# Altium schematic sheet main_board.SchDoc
size A4; SheetNumber: 1; SheetTotal: 2
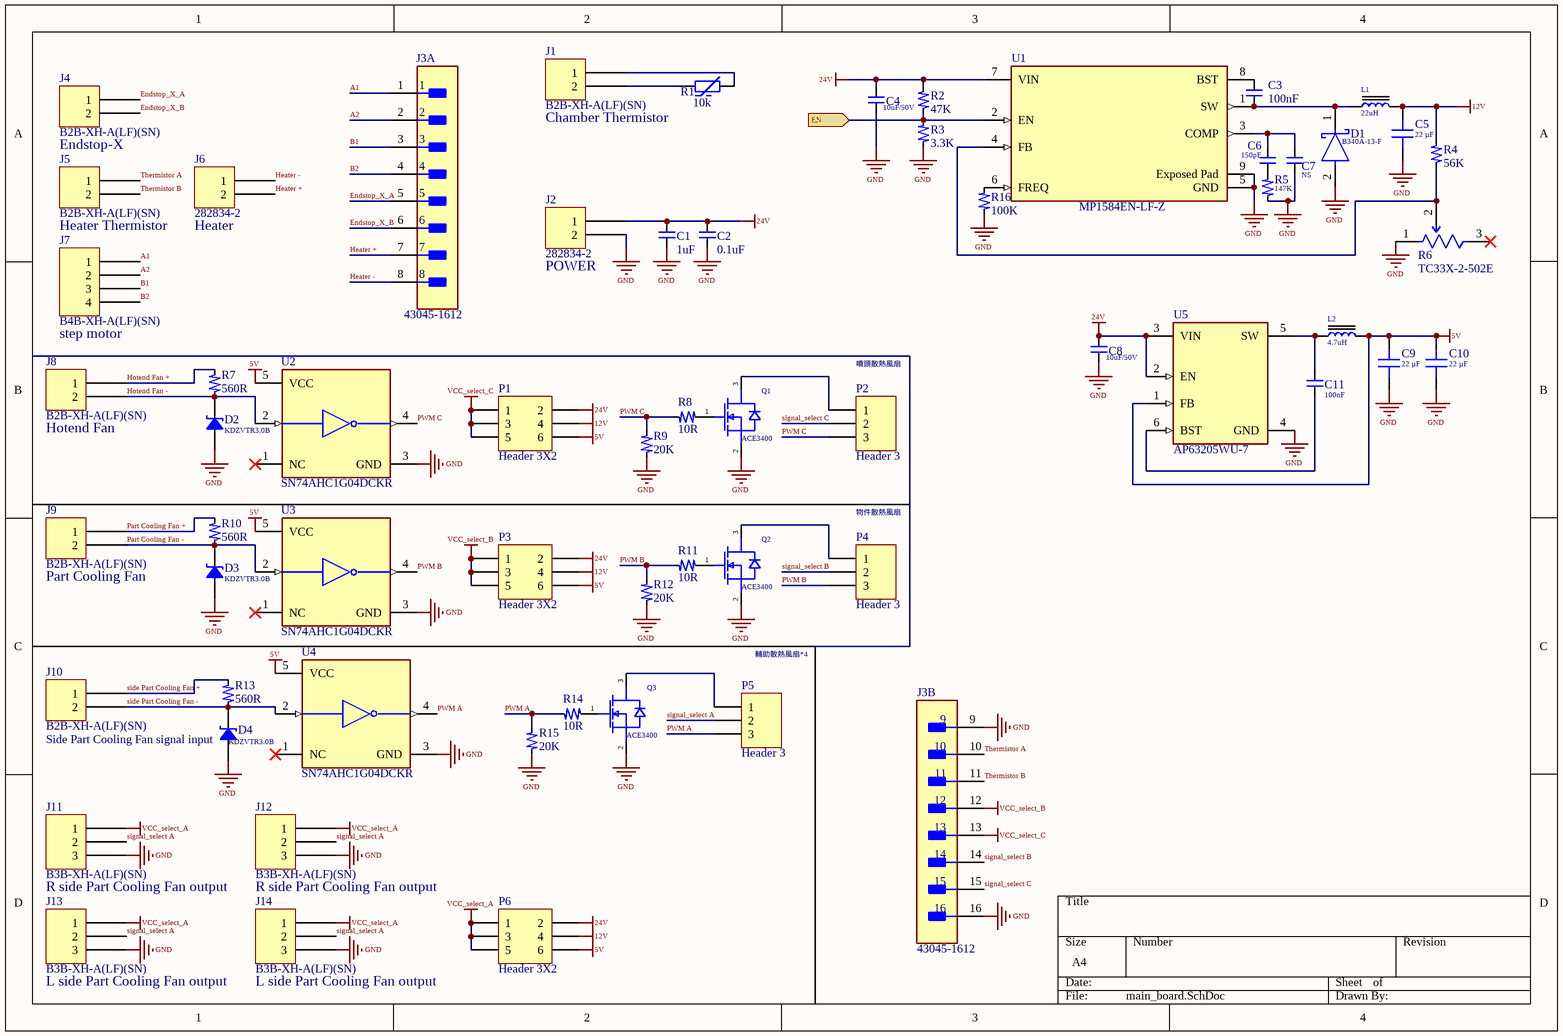
[diagram p0: main_board.SchDoc]

## Parts
C1  1uF  [0603 R]
C2  0.1uF  [0603 R]
C3  100nF  [0603 R]
C4  10uF/50V  [0603 R]
C5  22 µF  [CAP 1206_3216 - 0.8MM]
C6  150pF  [0603 R]
C7  NS  [0603 R]
C8  10uF/50V  [0603 R]
C9  22 µF  [CAP 1206_3216 - 0.8MM]
C10  22 µF  [CAP 1206_3216 - 0.8MM]
C11  100nF  [0603 R]
D1  B340A-13-F  [FP-SMA-MFG]
D2  KDZVTR3.0B  [SOD123F]
D3  KDZVTR3.0B  [SOD123F]
D4  KDZVTR3.0B  [SOD123F]
J1  B2B-XH-A(LF)(SN)  [JST XH B2B-XH-A]
J2  282834-2  [TE 282834-2]
J3  43045-1612  [FP-43045-1612-MFG]  (parts A,B of 2)
J4  B2B-XH-A(LF)(SN)  [JST XH B2B-XH-A]
J5  B2B-XH-A(LF)(SN)  [JST XH B2B-XH-A]
J6  282834-2  [TE 282834-2]
J7  B4B-XH-A(LF)(SN)  [JST XH B4B-XH-A]
J8  B2B-XH-A(LF)(SN)  [JST XH B2B-XH-A]
J9  B2B-XH-A(LF)(SN)  [JST XH B2B-XH-A]
J10  B2B-XH-A(LF)(SN)  [JST XH B2B-XH-A]
J11  B3B-XH-A(LF)(SN)  [JST XH B3B-XH-A]
J12  B3B-XH-A(LF)(SN)  [JST XH B3B-XH-A]
J13  B3B-XH-A(LF)(SN)  [JST XH B3B-XH-A]
J14  B3B-XH-A(LF)(SN)  [JST XH B3B-XH-A]
L1  22uH  [0850 I]
L2  4.7uH  [0630 I]
P1  Header 3X2  [HDR2X3]
P2  Header 3  [HDR1X3]
P3  Header 3X2  [HDR2X3]
P4  Header 3  [HDR1X3]
P5  Header 3  [HDR1X3]
P6  Header 3X2  [HDR2X3]
Q1  ACE3400  [SOT23-3]
Q2  ACE3400  [SOT23-3]
Q3  ACE3400  [SOT23-3]
R1  10k  [NTC 0805_2012]
R2  47K  [0603 R]
R3  3.3K  [0603 R]
R4  56K  [0603 R]
R5  147K  [0603 R]
R6  TC33X-2-502E  [FP-TC33X-2-MFG]
R7  560R  [0603 R]
R8  10R  [0603 R]
R9  20K  [0603 R]
R10  560R  [0603 R]
R11  10R  [0603 R]
R12  20K  [0603 R]
R13  560R  [0603 R]
R14  10R  [0603 R]
R15  20K  [0603 R]
R16  100K  [0603 R]
U1  MP1584EN-LF-Z  [FP-MP1584EN-LF-Z-MFG]
U2  SN74AHC1G04DCKR  [FP-DCK0005A-MFG]
U3  SN74AHC1G04DCKR  [FP-DCK0005A-MFG]
U4  SN74AHC1G04DCKR  [FP-DCK0005A-MFG]
U5  AP63205WU-7  [FP-TSOT26-MFG]

## Ports
EN (in)

## Nets
5V: C9.2 C10.2 L2.2 P1.6 P3.6 P6.6 U2.5(VCC) U3.5(VCC) U4.5(VCC) U5.1(FB)
12V: C5.2 L1.2 P1.4 P3.4 P6.4 R4.2
24V: C1.2 C2.2 C4.2 C8.2 J2.1 P1.2 P3.2 P6.2 R2.1 U1.7(VIN) U5.2(EN) U5.3(VIN)
GND: C1.1 C2.1 C4.1 C5.1 C7.1 C8.1 C9.1 C10.1 D1.2(A) D2.1 D3.1 D4.1 J2.2 J3.9 J3.16 J11.3 J12.3 J13.3 J14.3 Q1.2(S) Q2.2(S) Q3.2(S) R3.2 R5.2 R6.1(CCW) R9.1 R12.1 R15.1 R16.2 U1.5(GND) U1.9(Exposed_Pad) U2.3(GND) U3.3(GND) U4.3(GND) U5.4(GND)
VCC_select_A: J11.1 J12.1 J13.1 J14.1 P6.1 P6.3 P6.5
VCC_select_B: J3.12 P3.1 P3.3 P3.5
VCC_select_C: J3.13 P1.1 P1.3 P1.5
A1: J3.1 J7.1
A2: J3.2 J7.2
B1: J3.3 J7.3
B2: J3.4 J7.4
EN: R2.2 R3.1 U1.2(EN) ; port EN
Endstop_X_A: J3.5 J4.1
Endstop_X_B: J3.6 J4.2
Heater +: J3.7 J6.2
Heater -: J3.8 J6.1
Hotend Fan +: J8.1 R7.2
Hotend Fan -: D2.2 J8.2 R7.1 U2.2(A)
Part Cooling Fan +: J9.1 R10.2
Part Cooling Fan -: D3.2 J9.2 R10.1 U3.2(A)
PWM A: P5.3 R14.2 R15.2 U4.4(Y)
PWM B: P4.3 R11.2 R12.2 U3.4(Y)
PWM C: P2.3 R8.2 R9.2 U2.4(Y)
side Part Cooling Fan +: J10.1 R13.2
side Part Cooling Fan -: D4.2 J10.2 R13.1 U4.2(A)
signal_select A: J11.2 J12.2 J13.2 J14.2 P5.2
signal_select B: J3.14 P4.2
signal_select C: J3.15 P2.2
Thermistor A: J3.10 J5.1
Thermistor B: J3.11 J5.2
NetC3_1: C3.1 D1.1(C) L1.1 U1.1(SW)
NetC3_2: C3.2 U1.8(BST)
NetC6_1: C6.1 R5.1
NetC6_2: C6.2 C7.2 U1.3(COMP)
NetC11_1: C11.1 U5.6(BST)
NetC11_2: C11.2 L2.1 U5.5(SW)
NetJ1_1: J1.1 R1.2
NetJ1_2: J1.2 R1.1
NetP2_1: P2.1 Q1.3(D)
NetP4_1: P4.1 Q2.3(D)
NetP5_1: P5.1 Q3.3(D)
NetQ1_1: Q1.1(G) R8.1
NetQ2_1: Q2.1(G) R11.1
NetQ3_1: Q3.1(G) R14.1
NetR4_1: R4.1 R6.2(WIPER) U1.4(FB)
NetR16_1: R16.1 U1.6(FREQ)

Not connected (* = marked no-connect by the designer): R6 3(CW)*; U2 1(NC)*; U3 1(NC)*; U4 1(NC)*

## Notes on the sheet
- Endstop-X
- Chamber Thermistor
- Heater Thermistor
- (near J6) Heater
- (near J2) POWER
- step motor
- (near P2) 噴頭散熱風扇
- (near J8) Hotend Fan
- (near P4) 物件散熱風扇
- (near J9) Part Cooling Fan
- 輔助散熱風扇*4
- (near D4) Side Part Cooling Fan signal input
- R side Part Cooling Fan output
- L side Part Cooling Fan output

## Library data of the parts
C1-C4 C6-C8 C11 = Capacitors
C5 C9 C10 = GRM31CC81E226KE11L: CAP CER 22UF 25V X6S 1206; manufacturer: Murata Electronics; Tolerance: ±10%; Part Number: GRM31CC81E226KE11L; Value: 22 µF; Applications: General Purpose; Capacitance: 22 µF; componentlink1description: Datasheet; componentlink1url: https://search.murata.co.jp/Ceramy/image/img/A01X/G101/ENG/GRM31CC81E226KE11-01.pdf; componentlink2description: DigiKey Link; componentlink2url: https://www.digikey.com/en/products/detail/murata-electronics/GRM31CC81E226KE11L/6606097; Device Package: 1206 (3216 Metric); lastupdated: 2022/9/19 下午 01:06:42; Lifecycle Status: Active; Minimum Order: 1; Mounting Type: Surface Mount, MLCC; Operating Temperature: -55°C ~ 105°C; Package / Case: 1206 (3216 Metric); packaging: TapeAndReel; partid: 31407; Part Status: Active; price: 0.33; series: GRM; Size / Dimension: 0.126" L x 0.063" W (3.20mm x 1.60mm); Supplier 1: DigiKey; Supplier Part Number 1: 490-14468-1-ND; Temperature Coefficient: X6S; Thickness (Max): 0.075" (1.90mm); Voltage - Rated: 25V
D1 = CMP-1667-00003-3: DIODE SCHOTTKY 40V 3A SMA; Max Forward Surge Current (Ifsm): 80A; Forward Voltage: 500mV; Polarity: Standard; Max Reverse Current: 500uA; Capacitance: 250pF; Element Configuration: Single; Mount: Surface Mount; Output Current: 3A; Radiation Hardening: No; Width: 2.92mm; Current Rating: 3A; Termination: SMD/SMT; Voltage: 40V; Series: -; Max Operating Temperature: 125°C; Current: 3A; Max Repetitive Reverse Voltage (Vrrm): 40V; Min Operating Temperature: -55°C; REACH SVHC: No SVHC; Number of Pins: 2; Average Rectified Current: 3A; Contact Plating: Tin; RoHS Compliant: Yes; Max Reverse Voltage (DC): 40V; Packaging: Tape and Reel; Height: 2.3mm; Length: 4.6mm; Case/Package: SMA; Weight: 0.002258oz; Peak Non-Repetitive Surge Current: 80A; Package Quantity: 5000; Lead Free: Lead Free; Forward Current: 3A; Voltage Rating (DC): 40V
D2-D4 = KDZVTR3.0B: DIODE ZENER 3V 1W PMDU; Manufacturer: Rohm Semiconductor; Current - Reverse Leakage @ Vr: 100 µA @ 1 V; Tolerance: ±6.67%; Part Number: KDZVTR3.0B; ComponentLink1Description: Datasheet; ComponentLink1URL: https://www.rohm.com/datasheet/KDZV3.0B/kdzvtr3.0b-e; ComponentLink2Description: DigiKey Link; ComponentLink2URL: https://www.digikey.com/en/products/detail/rohm-semiconductor/KDZVTR3-0B/10670957; LastUpdated: 2022/9/19 下午 01:47:27; Lifecycle Status: Active; Minimum Order: 1; Mounting Type: Surface Mount; Operating Temperature: 150°C (TJ); Package / Case: SOD-123F; Packaging: TapeAndReel; PartId: 4172; Part Status: Active; Power - Max: 1 W; Price: 0.11; Series: -; Supplier 1: DigiKey; Supplier Part Number 1: 846-KDZVTR3.0BCT-ND; Supplier Device Package: PMDU; Voltage - Zener (Nom) (Vz): 3 V
J1 J4 J5 J8-J10 = B2B-XH-A(LF)(SN): CONN HEADER VERT 2POS 2.5MM; Manufacturer: JST Sales America Inc.; Contact Length - Post: 0.134" (3.40mm); Current Rating (Amps): 3A; Material Flammability Rating: UL94 V-0; Number of Positions: 2; Number of Positions Loaded: All; Pitch - Mating: 0.098" (2.50mm); Shrouding: Shrouded - 4 Wall; Style: Board to Cable/Wire; Voltage Rating: 250V; Part Number: B2B-XH-A(LF)(SN); ComponentLink1Description: Datasheet; ComponentLink1URL: http://www.jst-mfg.com/product/pdf/eng/eXH.pdf; ComponentLink2Description: DigiKey Link; ComponentLink2URL: http://digikey.com/product-detail/en/jst-sales-america-inc/B2B-XH-A-LF-SN/455-2247-ND/1651045; Connector Type: Header; Contact Finish - Mating: Tin; Contact Finish - Post: Tin; Contact Material: Brass; Contact Shape: Square; Contact Type: Male Pin; Fastening Type: Detent Lock; Insulation Color: Natural; Insulation Height: 0.276" (7.00mm); Insulation Material: Polyamide (PA66), Nylon 6/6; LastUpdated: 2020/1/12 下午 11:46:08; Lifecycle Status: Active; Minimum Order: 1; Mounting Type: Through Hole; Number of Rows: 1; Operating Temperature: -25°C ~ 85°C; Packaging: Bulk; PartId: 67; Part Status: Active; Price: 0.15; Series: XH; Supplier 1: DigiKey; Supplier Part Number 1: 455-2247-ND; Termination: Press-Fit, Solder
J2 J6 = 282834-2: TERM BLK 2P SIDE ENT 2.54MM PCB; Manufacturer: TE Connectivity AMP Connectors; Current: 10A; Mating Orientation: Horizontal with Board; Number of Levels: 1; Pitch: 0.100" (2.54mm); Positions Per Level: 2; Voltage: 150V; Wire Gauge: 16-30 AWG; Wire Termination: Screw - Rising Cage Clamp; Part Number: 282834-2; Color: Green; ComponentLink1Description: Datasheet; ComponentLink1URL: https://www.te.com/commerce/DocumentDelivery/DDEController?Action=srchrtrv&DocNm=282834&DocType=Customer+Drawing&DocLang=English; ComponentLink2Description: DigiKey Link; ComponentLink2URL: http://digikey.com/product-detail/en/te-connectivity-amp-connectors/282834-2/A98333-ND/1150135; LastUpdated: 2020/1/15 上午 04:15:38; Lifecycle Status: Active; Minimum Order: 1; Mounting Type: Through Hole; Packaging: Bulk; Part Status: Active; Price: 0.88; Series: Buchanan; Supplier 1: DigiKey; Supplier Part Number 1: A98333-ND
J3 = CMP-04776-000281-1: CONN HEADER VERT 16POS 3MM; Insulation Resistance: 1GR; Working Voltage: 250V; Number of Poles: 16; Current Rating: 5A; Mating Cycles: 30; Contact Resistance: 10mR; Max Voltage Rating (DC): 250.25kV; Approvals: UL; Connector Type: Power; Voltage Rating: 600V; Gender: Male; Glow Wire Compliant: Compliant; Series: 43045; Number of Rows: 2; Depth: 8.77mm; RoHS Compliant: Yes; Packaging: Tray; Height: 9.91mm; Housing Material: Thermoplastic; Mount: Through Hole; Lead Free: Lead Free; Max Current Rating: 5A; Halogen Free: Low Halogen; Length: 28.15mm; Material: Polyester; Voltage Rating (AC): 250V; Max Operating Temperature: 105°C; Contact Plating: Tin; Termination: Solder; Color: Black; Contact Material: Brass; Min Operating Temperature: -40°C; REACH SVHC: No SVHC; Orientation: Vertical; Package Quantity: 792; Voltage Rating (DC): 250V; Row Spacing: 3mm; Number of Contacts: 16; Housing Color: Black; Pitch: 3mm; Number of Circuits: 16; Operating Supply Voltage: 250V; Number of Positions: 16; Flammability Rating: UL94 V-0
J7 = B4B-XH-A(LF)(SN): CONN HEADER VERT 4POS 2.5MM; Manufacturer: JST Sales America Inc.; Contact Length - Post: 0.134" (3.40mm); Current Rating (Amps): 3A; Material Flammability Rating: UL94 V-0; Number of Positions: 4; Number of Positions Loaded: All; Pitch - Mating: 0.098" (2.50mm); Shrouding: Shrouded - 4 Wall; Style: Board to Cable/Wire; Voltage Rating: 250V; Part Number: B4B-XH-A(LF)(SN); ComponentLink1Description: Datasheet; ComponentLink1URL: http://www.jst-mfg.com/product/pdf/eng/eXH.pdf; ComponentLink2Description: DigiKey Link; ComponentLink2URL: http://digikey.com/product-detail/en/jst-sales-america-inc/B4B-XH-A-LF-SN/455-2249-ND/1651047; Connector Type: Header; Contact Finish - Mating: Tin; Contact Finish - Post: Tin; Contact Material: Brass; Contact Shape: Square; Contact Type: Male Pin; Fastening Type: Detent Lock; Insulation Color: Natural; Insulation Height: 0.276" (7.00mm); Insulation Material: Polyamide (PA66), Nylon 6/6; LastUpdated: 2020/1/12 下午 11:46:34; Lifecycle Status: Active; Minimum Order: 1; Mounting Type: Through Hole; Number of Rows: 1; Operating Temperature: -25°C ~ 85°C; Packaging: Bulk; PartId: 69; Part Status: Active; Price: 0.21; Series: XH; Supplier 1: DigiKey; Supplier Part Number 1: 455-2249-ND; Termination: Press-Fit, Solder
J11-J14 = B3B-XH-A(LF)(SN): CONN HEADER VERT 3POS 2.5MM; Manufacturer: JST Sales America Inc.; Contact Length - Post: 0.134" (3.40mm); Current Rating (Amps): 3A; Material Flammability Rating: UL94 V-0; Number of Positions: 3; Number of Positions Loaded: All; Pitch - Mating: 0.098" (2.50mm); Shrouding: Shrouded - 4 Wall; Style: Board to Cable/Wire; Voltage Rating: 250V; Part Number: B3B-XH-A(LF)(SN); ComponentLink1Description: Datasheet; ComponentLink1URL: http://www.jst-mfg.com/product/pdf/eng/eXH.pdf; ComponentLink2Description: DigiKey Link; ComponentLink2URL: http://digikey.com/product-detail/en/jst-sales-america-inc/B3B-XH-A-LF-SN/455-2248-ND/1651046; Connector Type: Header; Contact Finish - Mating: Tin; Contact Finish - Post: Tin; Contact Material: Brass; Contact Shape: Square; Contact Type: Male Pin; Fastening Type: Detent Lock; Insulation Color: Natural; Insulation Height: 0.276" (7.00mm); Insulation Material: Polyamide (PA66), Nylon 6/6; LastUpdated: 2020/1/12 下午 11:46:22; Lifecycle Status: Active; Minimum Order: 1; Mounting Type: Through Hole; Number of Rows: 1; Operating Temperature: -25°C ~ 85°C; Packaging: Bulk; PartId: 68; Part Status: Active; Price: 0.19; Series: XH; Supplier 1: DigiKey; Supplier Part Number 1: 455-2248-ND; Termination: Press-Fit, Solder
L1 L2 = Inductor
P1 P3 P6 = Header 3X2: Header, 3-Pin, Dual row; LatestRevisionDate: 17-Jul-2002; LatestRevisionNote: Re-released for DXP Platform.; Publisher: Altium Limited
P2 P4 P5 = Header 3: Header, 3-Pin; LatestRevisionDate: 17-Jul-2002; LatestRevisionNote: Re-released for DXP Platform.; Publisher: Altium Limited
R1 = NTCG203NF103JTDS: CASE EIA 0805 B= 1% ,10K? 5%; Manufacturer: TDK Corporation; B25/100: 3670K; B25/50: 3590K; B25/75: 3635K; B25/85: 3650K; Power - Max: 100mW; Part Number: NTCG203NF103JTDS; B Value Tolerance: ±1%; ComponentLink2Description: DigiKey Link; ComponentLink2URL: http://digikey.com/product-detail/en/tdk-corporation/NTCG203NF103JTDS/445-NTCG203NF103JTTR-ND/10820112; LastUpdated: 2020/8/30 下午 09:02:56; Lifecycle Status: Active; Minimum Order: 2000; Mounting Type: Surface Mount; Operating Temperature: -40°C ~ 125°C; Package / Case: 0805 (2012 Metric); Packaging: TapeAndReel; PartId: 1371; Price: 0.13; Resistance in Ohms @ 25°C: 10k; Resistance Tolerance: ±5%; Series: NTCG; Supplier 1: DigiKey; Supplier Part Number 1: 445-NTCG203NF103JTTR-ND; Value: 10k
R2-R5 R7-R16 = Resistors
R6 = CMP-07234-000040-1: TRIMMER 5K OHM 0.1W J LEAD TOP; Number of Turns: 1; Voltage Rating (DC): 50V; Power Rating: 100mW; Resistance Tolerance: 25%; Resistance: 100kR; Temperature Coefficient: 250ppm/°C; Max Operating Temperature: 100°C; Package Quantity: 2500; REACH SVHC: No SVHC; Termination: Foot Print; Packaging: Tape and Reel; RoHS Compliant: Yes; Military Standard: Not; Color: Silver; Width: 0.118inch; Min Operating Temperature: -40°C; Mount: Surface Mount; Height: 0.047inch; Tolerance: 25%; Resistor Type: Carbon; Length: 3mm; Depth: 3.8mm; Weight: 29.4mg; Max Power Dissipation: 100mW; Series: TC33; Radiation Hardening: No
U1 = CMP-57379-000006-1: IC REG BUCK ADJ 3A; Manufacturer: Monolithic Power Systems; Output Type: AdjustableProgrammable; Nominal Supply Current: 100uA; Switching Frequency: 100-1500kHz; Max Power Dissipation: 2.5W; Output Voltage: 0.8-25V; Max Junction Temp: +125°C; Min Supply Voltage: 4.5V; Max Supply Voltage: 28V; Number Of Outputs: 1; Standoff Height: 0mm; ComponentLink2URL: https://www.monolithicpower.com/en/documentview/productdocument/index/doc_url/L01QMTU4NF9yMS4wLnBkZg%3D%3D/release_date/MjAwOS0wNC0wOSAwMDowMDowMA%3D%3D/; Lead Free: Yes; Package: MP1584EN-LF-Z; Temperature Range Low: -20°C; Temperature: -20°C to +125°C; Height: 1.7mm; Ambient Temperature Range Low: -20°C; RoHS: TRUE; Automotive: No; Ipc Land Pattern Name: SOIC127P600X150-8; Ambient Temperature Range High: +85°C; Device Class L2: Power Management ICs; ComponentLink2Description: Datasheet; Manufacturer Part Number: MP1584EN-LF-Z; Device Class L3: Voltage Regulators - Switching; Octopart: https://octopart.com/mp1584en-lf-z-monolithic+power+systems-18629680; Category: IC; Output Current: 3A; Digikey Description: IC REG BUCK ADJ 3A; Temperature Range High: +125°C; Device Class L1: Integrated Circuits (ICs); Switching Topology: Buck
U2-U4 = CMP-0859-00383-4: IC INVERTER 1CH 1-INP SC70-5; Manufacturer: Texas Instruments; Number Of Circuits: 1; Logic Function Desc: Inverting; Max Junction Temp: +150°C; Max Supply Voltage: 5.5V; Nominal Supply Current: 1uA; Standoff Height: 0mm; Min Supply Voltage: 2V; Height: 1.1mm; Temperature: -40°C to +125°C; Manufacturer Part Number: SN74AHC1G04DCKR; Temperature Range High: +125°C; Temperature Range Low: -40°C; Number Of Inputs: 1; Number Of Outputs: 1; RoHS: TRUE; Ambient Temperature Range Low: -40°C; Octopart: https://octopart.com/sn74ahc1g04dckr-texas+instruments-464403; Package: DCK0005A; Mouser Description: Inverter 1 Element CMOS 5-Pin SC-70 Tape and Reel; Ambient Temperature Range High: +125°C; Digikey Description: IC INVERTER 1CH 1-INP SC70-5; ComponentLink2Description: Datasheet; Automotive: No; Device Class L1: Integrated Circuits (ICs); Lead Free: Yes; Category: IC; ComponentLink2URL: http://www.ti.com/lit/ds/symlink/sn74ahc1g04.pdf; Device Class L3: Logic Gates; Device Class L2: Logic ICs
U5 = CMP-12757-000001-1: IC REG BUCK 5V 2A TSOT26; Manufacturer: Diodes Inc.; Max Junction Temp: +160°C; Max Duty Cycle: 100%; Standoff Height: 0.01mm; Max Supply Voltage: 32V; Number Of Outputs: 1; Min Supply Voltage: 3.8V; Output Type: Fixed; Switching Frequency: 1100kHz; Nominal Supply Current: 22uA; Automotive: No; RoHS: TRUE; Switching Topology: Buck; Temperature: -40°C to +85°C; Footprint Url: https://www.diodes.com/assets/Package-Files/TSOT26.pdf; Lead Free: Yes; Digikey Description: IC REG BUCK 5V 2A TSOT26; Device Class L3: Voltage Regulators - Switching; Ambient Temperature Range High: +85°C; Category: IC; Package: TSOT26; Output Voltage: 5V; Output Current: 2A; ComponentLink2Description: Datasheet; Device Class L2: Power Management ICs; Ambient Temperature Range Low: -40°C; Temperature Range High: +85°C; Temperature Range Low: -40°C; Octopart: https://octopart.com/ap63205wu-7-diodes+inc.-98099551; Manufacturer Part Number: AP63205WU-7; Height: 1mm; Device Class L1: Integrated Circuits (ICs); ComponentLink2URL: https://www.diodes.com/assets/Datasheets/AP63200-AP63201-AP63203-AP63205.pdf